# Altium schematic sheet V1.0.SchDoc
size 152 x 101 mm
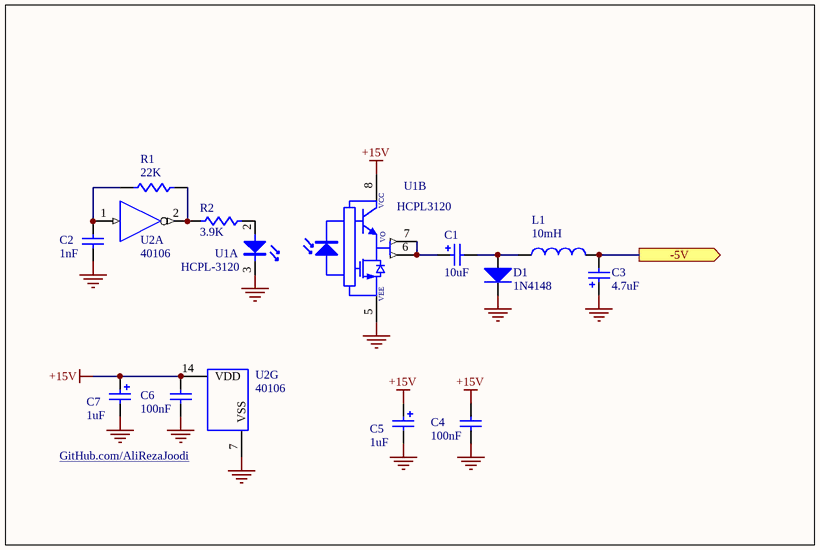
[diagram p0: V1.0.SchDoc]

## Parts
C1  value 10uF  [CAPPR2.5-6.3x5]  (hidden comment: Cap Pol1)
C2  value 1nF  [CAPNTO2.54-3.05x1.78A]  (hidden comment: Cap)
C3  value 4.7uF  [CAPPR2.5-6.3x5]  (hidden comment: Cap Pol1)
C4  value 100nF  [CAPNTO2.54-3.05x1.78A]
C5  value 1uF  [CAPPR2.5-6.3x5]
C6  value 100nF  [CAPNTO2.54-3.05x1.78A]
C7  value 1uF  [CAPPR2.5-6.3x5]
D1  value 1N4148  [DIODE-0.4]  (hidden comment: Diode)
L1  value 10mH  [INDUCTOR-2V]  (hidden comment: Inductor)
R1  value 22K  [AXIAL-0.4]
R2  value 3.9K  [AXIAL-0.4]
U1  HCPL-3120  [DIP8]  (parts A,B of 2)
U2  40106  [DIP14]  (parts A,G of 7)

## Ports
-5V (out)

## Nets
+15V: C4.2 C5.1 C6.2 C7.1 U1.8(VCC) U2.14(VDD)
GND: C2.2 C3.1 C4.1 C5.2 C6.1 C7.2 D1.2(K) U1.3(K) U1.5(VEE) U2.7(VSS)
-5V: C3.2 L1.2 ; port -5V
NetC1_1: C1.1 U1.6(VO) U1.7(VO)
NetC1_2: C1.2 D1.1(A) L1.1
NetC2_1: C2.1 R1.2 U2.1(I)
NetR1_1: R1.1 R2.1 U2.2(~{O})
NetR2_2: R2.2 U1.2(A)

## Notes on the sheet
- (near U2) GitHub.com/AliRezaJoodi

## Library data of the parts
C1 C3 C5 C7 = Cap Pol1: Polarized Capacitor (Radial); Manufacturer: Generic Components; Class I: Passive; Published: 8-Jun-2000; Revision: July-2002: Re-released for DXP Platform.; Publisher: Altium Limited; Class II: Capacitor
C2 C4 C6 = Cap: Capacitor; Manufacturer: Generic Components; Class I: Passive; Published: 8-Jun-2000; Revision: July-2002: Re-released for DXP Platform.; Publisher: Altium Limited; Class II: Capacitor
D1 = Diode: Default Diode; Manufacturer: Generic Components; Class I: Discrete; Class II: Diode - Switching; Published: 8-Jun-2000; Revision: July-2002: Re-released for DXP Platform.; Publisher: Altium Limited
L1 = Inductor: Code_IEC: 1005; Published: 8-Jun-2000; LatestRevisionDate: 29-May-2009; LatestRevisionNote: IPC-7351 Footprint Added.; PackageReference: 0402-A; Publisher: Altium Limited; PackageDescription: Chip Inductor; Code_JEITA: 0402
R1 R2 = Res1: Resistor; Manufacturer: Generic Components; Class I: Passive; Published: 8-Jun-2000; Revision: July-2002: Re-released for DXP Platform.; Publisher: Altium Limited; Class II: Resistor
U2 = 40106: Hex inverting Schmitt trigger, 14-Pin; Publisher: Altium Limited; ComponentLink1URL: http://www.nxp.com